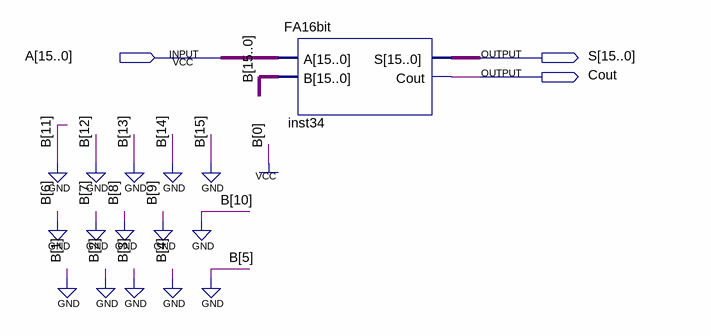
[diagram p0: schematic sheet]
// Quartus schematic FAdder1.bdf as structural Verilog: 1 symbols, 3 pins
module FAdder1 (
  input  [15:0] A,
  output [15:0] S,
  output Cout
);

  FA16bit inst34 (.A(A), .B(16'b0000000000000001), .S(S), .Cout(Cout));
endmodule
